# Altium schematic sheet [00] ESP8266 CH340.SchDoc (part 3 of 3)
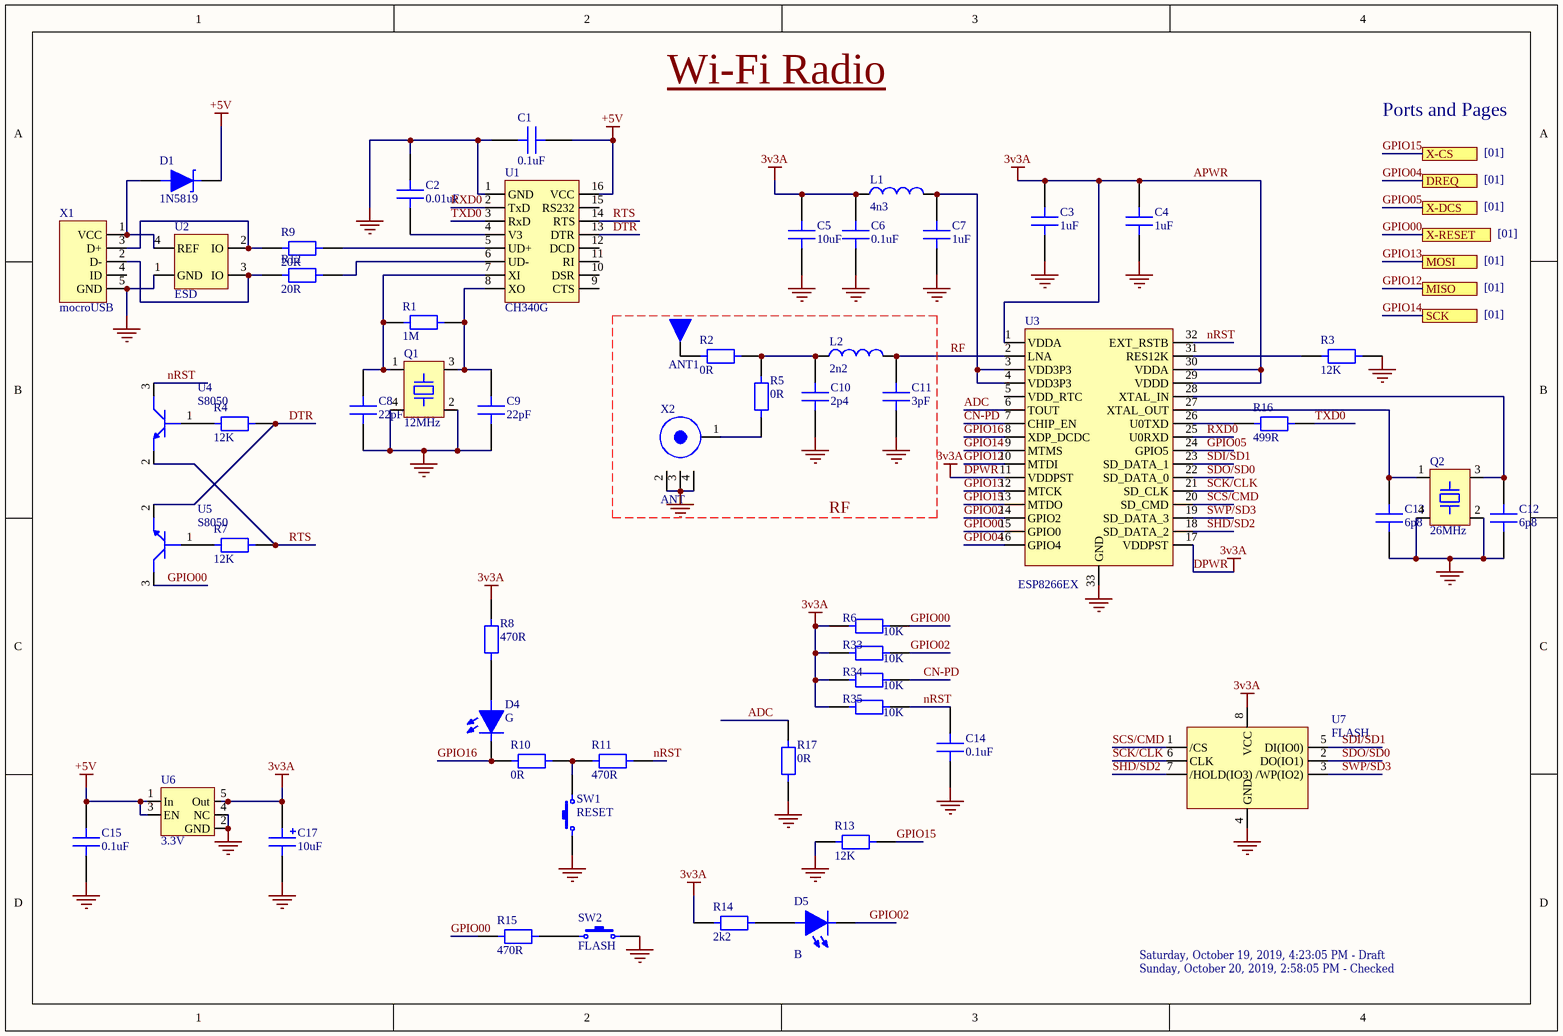
[diagram p2: [00] ESP8266 CH340.SchDoc]

## Library data of the parts (continued)
U6 = TLV70233DBVR: IC REG LIN 3.3V 300mALow IQLDO Reg; Manufacturer: Texas Instruments; Output Current: 300mA; Number of Outputs: 1; Max Power Dissipation: 500mW; Dropout Voltage: 375mV; Max Input Voltage: 5.5V; Min Input Voltage: 2V; Min Current Limit: 320mA; Polarity: Positive; Output Voltage Accuracy: 0.5%; Accuracy: 2%; Quiescent Current: 30uA; Power Supply Rejection Ratio (PSRR): 68dB; Output Type: Fixed; Supplier 1: Digi-Key; Supplier Part Number 1: 296-32415-1-ND; Manufacturer Part Number: TLV70233DBVR; Stock 1: 29164; Pricing 1: 1=0.5, 10=0.428, 100=0.3192, 500=0.2508, 1000=0.1938 (USD); Case/Package: SOT-23-5; Number of Pins: 5; Min Operating Temperature: -40°C; Max Operating Temperature: 125°C; Output Voltage: 3.3V; Packaging: Tape and Reel; Package Quantity: 1; Nominal Output Voltage: 3.3V; Max Output Current: 300mA; Number of Regulators: 1; Power Dissipation: 500mW; Min Output Voltage: 3.3V; Max Output Voltage: 3.3V; Radiation Hardening: No; REACH SVHC: No SVHC; Lead Free: Lead Free; ComponentLink1URL: http://www.farnell.com/datasheets/1882072.pdf?src-supplier=Element14; ComponentLink1Description: http://www.farnell.com/datasheets/1882072.pdf?src-supplier=Element14; ComponentLink2URL: http://www.ti.com/lit/ds/symlink/tlv702.pdf?src-supplier=Digi-Key; ComponentLink2Description: http://www.ti.com/lit/ds/symlink/tlv702.pdf?src-supplier=Digi-Key
U7 = W25Q32JVSSIQTR: IC FLASH 32M SPI 133MHZ 8SOIC; Manufacturer: Winbond; Memory Type: FLASH,NOR; Frequency: 104MHz; Interface: SPI,Serial; Supplier 1: Digi-Key; Supplier Part Number 1: W25Q32JVSSIQCT-ND; Manufacturer Part Number: W25Q32JVSSIQTR; Stock 1: 121887; Case/Package: SOIC; Min Operating Temperature: -40°C; Max Operating Temperature: 85°C; Packaging: Tape and Reel; ComponentLink1URL: http://www.winbond.com/resource-files/w25q32jv%20revg%2003272018%20plus.pdf?src-supplier=Digi-Key; ComponentLink1Description: http://www.winbond.com/resource-files/w25q32jv%20revg%2003272018%20plus.pdf?src-supplier=Digi-Key
X1 = 105017-1001: CONN USB Type B RCP 5 POS 0.65mm Solder RA Thru-Hole 5 Terminal 1 Port Embossed T/R; Manufacturer: Molex; Gender: Receptacle; Number of Contacts: 5; Number of Ports: 1; Max Voltage Rating (AC): 30V; USB Standard: USB 2.0; Supplier 1: Digi-Key; Supplier Part Number 1: WM11262CT-ND; Manufacturer Part Number: 105017-1001; Stock 1: 8707; Pricing 1: 1=1.6, 10=1.456, 25=1.3668, 50=1.3072, 100=1.2479, 250=1.129, 500=1.0399, 1000=0.8913 (USD); Mount: Surface Mount,Horizontal,Through Hole; Contact Material: Copper Alloy; Contact Plating: Gold; Number of Terminals: 5; Housing Material: Polymer; Min Operating Temperature: -30°C; Max Operating Temperature: 85°C; Packaging: Tape and Reel; Package Quantity: 1; Connector Type: USB; Termination: Solder; Orientation: Right Angle; Length: 7.5mm; Pitch: 0.65mm; Depth: 5mm; Radiation Hardening: No; REACH SVHC: No SVHC; ComponentLink1URL: http://www.molex.com/pdm_docs/sd/1050171001_sd.pdf?src-supplier=Digi-Key; ComponentLink1Description: http://www.molex.com/pdm_docs/sd/1050171001_sd.pdf?src-supplier=Digi-Key; ComponentLink2URL: https://www.verical.com/server-webapp/html/getDatasheet?partID=551961&src-supplier=Verical; ComponentLink2Description: https://www.verical.com/server-webapp/html/getDatasheet?partID=551961&src-supplier=Verical
X2 = 73412-0110: CONN U.FL 50OHM MOLEX 73412-0110 RF COAXIAL, MICROCOAXIAL, JACK; Body Material: Polymer,Liquid Crystal Polymer; Body Plating: Gold; Impedance: 50R; Voltage Rating: 60V; Frequency: 6GHz; Gender: Female; Mating Cycles: 30; Insulation Resistance: 500MR; Polarity: Standard; Supplier 1: Digi-Key; Supplier Part Number 1: WM5587CT-ND; Manufacturer: Molex; Manufacturer Part Number: 73412-0110; Stock 1: 91172; Pricing 1: 1=0.77, 10=0.722, 25=0.6496, 50=0.5774, 100=0.5533, 250=0.5052, 500=0.4811, 1000=0.3969, 2500=0.3609 (USD); Mount: Surface Mount,Through Hole,PCB; Contact Material: Bronze,Brass; Contact Plating: Gold; Material: Bronze; Min Operating Temperature: -40°C; Max Operating Temperature: 90°C; Package Quantity: 5000; Packaging: Tape and Reel; Max Frequency: 6GHz; Termination: Solder; Connector Type: Coaxial; Voltage Rating (AC): 60V; Orientation: Straight; Radiation Hardening: No; REACH SVHC: Unknown; Halogen Free: Low Halogen; Lead Free: Lead Free; ComponentLink1URL: http://www.molex.com/webdocs/datasheets/pdf/en-us/0734120110_RF_COAX_CONNECTORS.pdf?src-supplier=Avnet+Europe; ComponentLink1Description: http://www.molex.com/webdocs/datasheets/pdf/en-us/0734120110_RF_COAX_CONNECTORS.pdf?src-supplier=Avnet+Europe; ComponentLink2URL: http://uk.rs-online.com/webdocs/13c4/0900766b813c49d5.pdf?src-supplier=RSComponents; ComponentLink2Description: http://uk.rs-online.com/webdocs/13c4/0900766b813c49d5.pdf?src-supplier=RSComponents; ComponentLink3URL: http://www.farnell.com/datasheets/1841262.pdf?src-supplier=Farnell; ComponentLink3Description: http://www.farnell.com/datasheets/1841262.pdf?src-supplier=Farnell; ComponentLink4URL: http://www.molex.com/webdocs/datasheets/pdf/en-us/0734120110_RF_COAX_CONNECTORS.pdf?src-supplier=Mouser; ComponentLink4Description: http://www.molex.com/webdocs/datasheets/pdf/en-us/0734120110_RF_COAX_CONNECTORS.pdf?src-supplier=Mouser; ComponentLink5URL: http://www.onlinecomponents.com/productFiles/mf-MOL/1387750734120110_rf_coax_nectors.pdf?src-supplier=Onlinecomponents.com; ComponentLink5Description: http://www.onlinecomponents.com/productFiles/mf-MOL/1387750734120110_rf_coax_nectors.pdf?src-supplier=Onlinecomponents.com; ComponentLink6URL: http://www.farnell.com/datasheets/2698444.pdf?src-supplier=Element14; ComponentLink6Description: http://www.farnell.com/datasheets/2698444.pdf?src-supplier=Element14; ComponentLink7URL: http://www.molex.com/webdocs/datasheets/pdf/en-us/0734120110_RF_COAX_CONNECTORS.pdf?src-supplier=Avnet; ComponentLink7Description: http://www.molex.com/webdocs/datasheets/pdf/en-us/0734120110_RF_COAX_CONNECTORS.pdf?src-supplier=Avnet